# EAGLE design panelPrimer (EAGLE 9.4.2)
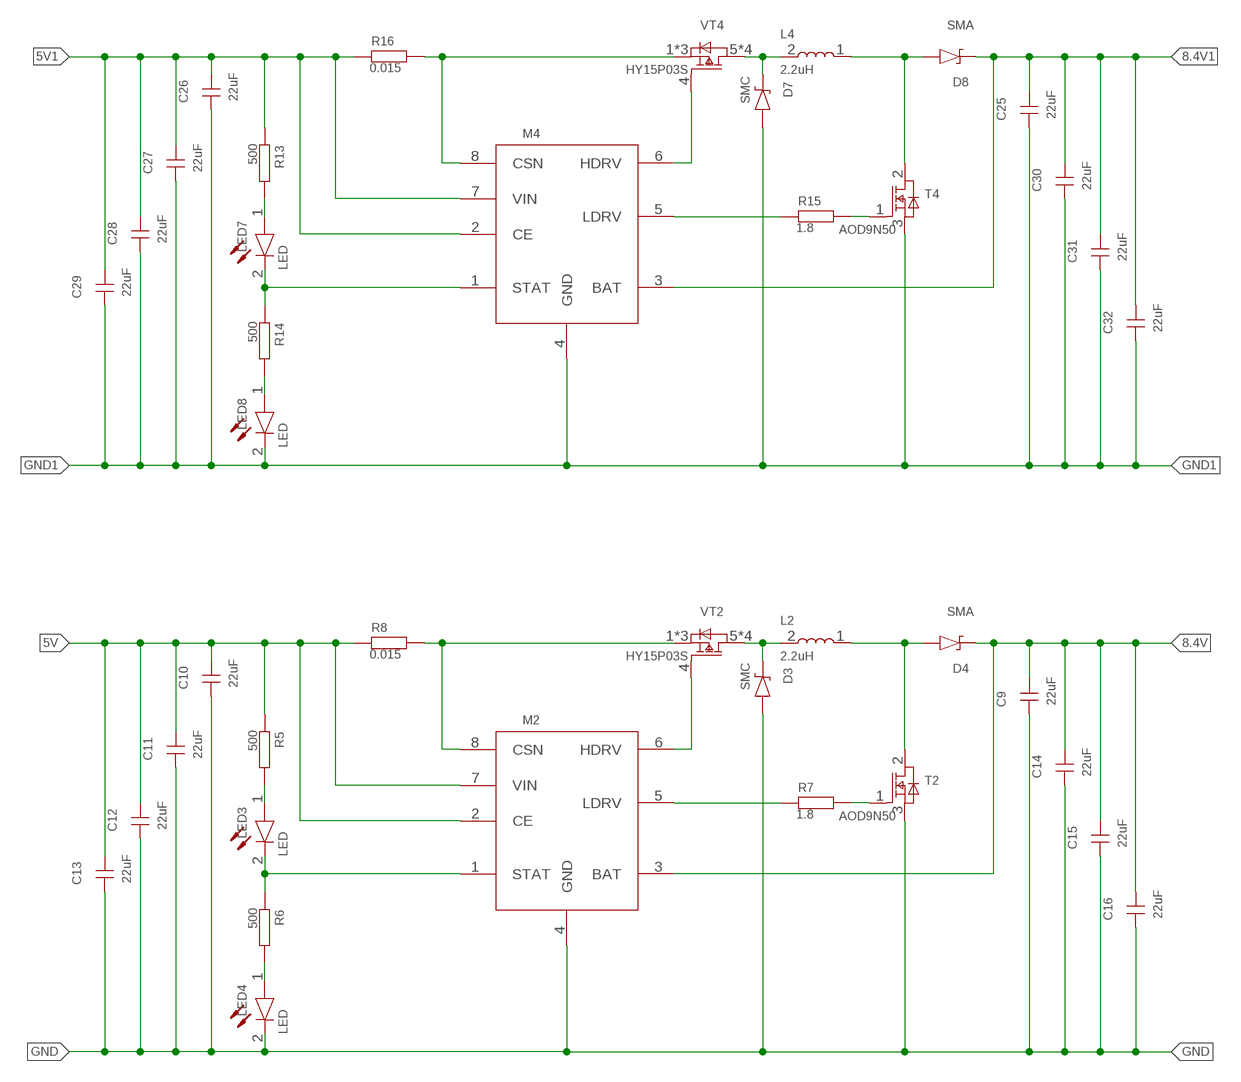
[diagram p0: schematic, sheet 1]

## Parts
C9  22uF  CAPACITOR  [1206]
C10  22uF  CAPACITOR  [1206]
C11  22uF  CAPACITOR  [1206]
C12  22uF  CAPACITOR  [1206]
C13  22uF  CAPACITOR  [1206]
C14  22uF  CAPACITOR  [1206]
C15  22uF  CAPACITOR  [1206]
C16  22uF  CAPACITOR  [1206]
C25  22uF  CAPACITOR  [1206]
C26  22uF  CAPACITOR  [1206]
C27  22uF  CAPACITOR  [1206]
C28  22uF  CAPACITOR  [1206]
C29  22uF  CAPACITOR  [1206]
C30  22uF  CAPACITOR  [1206]
C31  22uF  CAPACITOR  [1206]
C32  22uF  CAPACITOR  [1206]
D3  SMC  DIODESSMC  [SMC]
D4  SMA  DIODESSMA  [SMA]
D7  SMC  DIODESSMC  [SMC]
D8  SMA  DIODESSMA  [SMA]
L2  2.2uH  INDUCTORFXL0530-2R2-M  [FXL0530]
L4  2.2uH  INDUCTORFXL0530-2R2-M  [FXL0530]
LED3  LED  [LED]
LED4  LED  [LED]
LED7  LED  [LED]
LED8  LED  [LED]
M2  CN3302SOP-8  [SOP-8]
M4  CN3302SOP-8  [SOP-8]
R5  500  RESISTOR0603  [0603]
R6  500  RESISTOR0603  [0603]
R7  1.8  RESISTOR0603  [0603]
R8  0.015  RESISTOR2512  [2512]
R13  500  RESISTOR0603  [0603]
R14  500  RESISTOR0603  [0603]
R15  1.8  RESISTOR0603  [0603]
R16  0.015  RESISTOR2512  [2512]
T2  AOD9N50  AOD9N50  [DRACK]
T4  AOD9N50  AOD9N50  [DRACK]
VT2  HY15P03S  [SOP-8]
VT4  HY15P03S  [SOP-8]

## Nets
5V: C10.2 C11.2 C12.2 C13.2 M2.2(CE) M2.7(VIN) R5.1 R8.1
5V1: C26.2 C27.2 C28.2 C29.2 M4.2(CE) M4.7(VIN) R13.1 R16.1
8.4V: C9.2 C14.2 C15.2 C16.2 D4.2(C) M2.3(BAT)
8.4V1: C25.2 C30.2 C31.2 C32.2 D8.2(C) M4.3(BAT)
GND: C9.1 C10.1 C11.1 C12.1 C13.1 C14.1 C15.1 C16.1 D3.1(A) LED4.2(CATHODE) M2.4(GND) T2.3(S)
GND1: C25.1 C26.1 C27.1 C28.1 C29.1 C30.1 C31.1 C32.1 D7.1(A) LED8.2(CATHODE) M4.4(GND) T4.3(S)
N$16: LED3.1(ANODE) R5.2
N$17: LED4.1(ANODE) R6.2
N$18: M2.5(LDRV) R7.1
N$19: M2.8(CSN) R8.2 VT2.1(S) VT2.2(S) VT2.3(S)
N$20: R7.2 T2.1(G)
N$21: D3.2(C) L2.2 VT2.5(D) VT2.6(D) VT2.7(D) VT2.8(D)
N$22: D4.1(A) L2.1 T2.2(D)
N$23: LED3.2(CATHODE) M2.1(STAT) R6.1
N$24: M2.6(HDRV) VT2.4(G)
N$46: LED7.1(ANODE) R13.2
N$47: LED8.1(ANODE) R14.2
N$48: M4.5(LDRV) R15.1
N$49: M4.8(CSN) R16.2 VT4.1(S) VT4.2(S) VT4.3(S)
N$50: R15.2 T4.1(G)
N$51: D7.2(C) L4.2 VT4.5(D) VT4.6(D) VT4.7(D) VT4.8(D)
N$52: D8.1(A) L4.1 T4.2(D)
N$53: LED7.2(CATHODE) M4.1(STAT) R14.1
N$54: M4.6(HDRV) VT4.4(G)

## Library data of the parts
C9-C16 C25-C32 = 1_RESISTORS:CAPACITOR
D3 D4 D7 D8 = 1_DIODES:DIODES
L2 L4 = 1_INDUCTOR:INDUCTOR
LED3 LED4 LED7 LED8 = 1_LED:LED
M2 M4 = 1_MICRO:CN3302
R5-R8 R13-R16 = 1_RESISTORS:RESISTOR
T2 T4 = 1_TRANSISTORS:AOD9N50
VT2 VT4 = 1_TRANSISTORS:HY15P03S

## Board
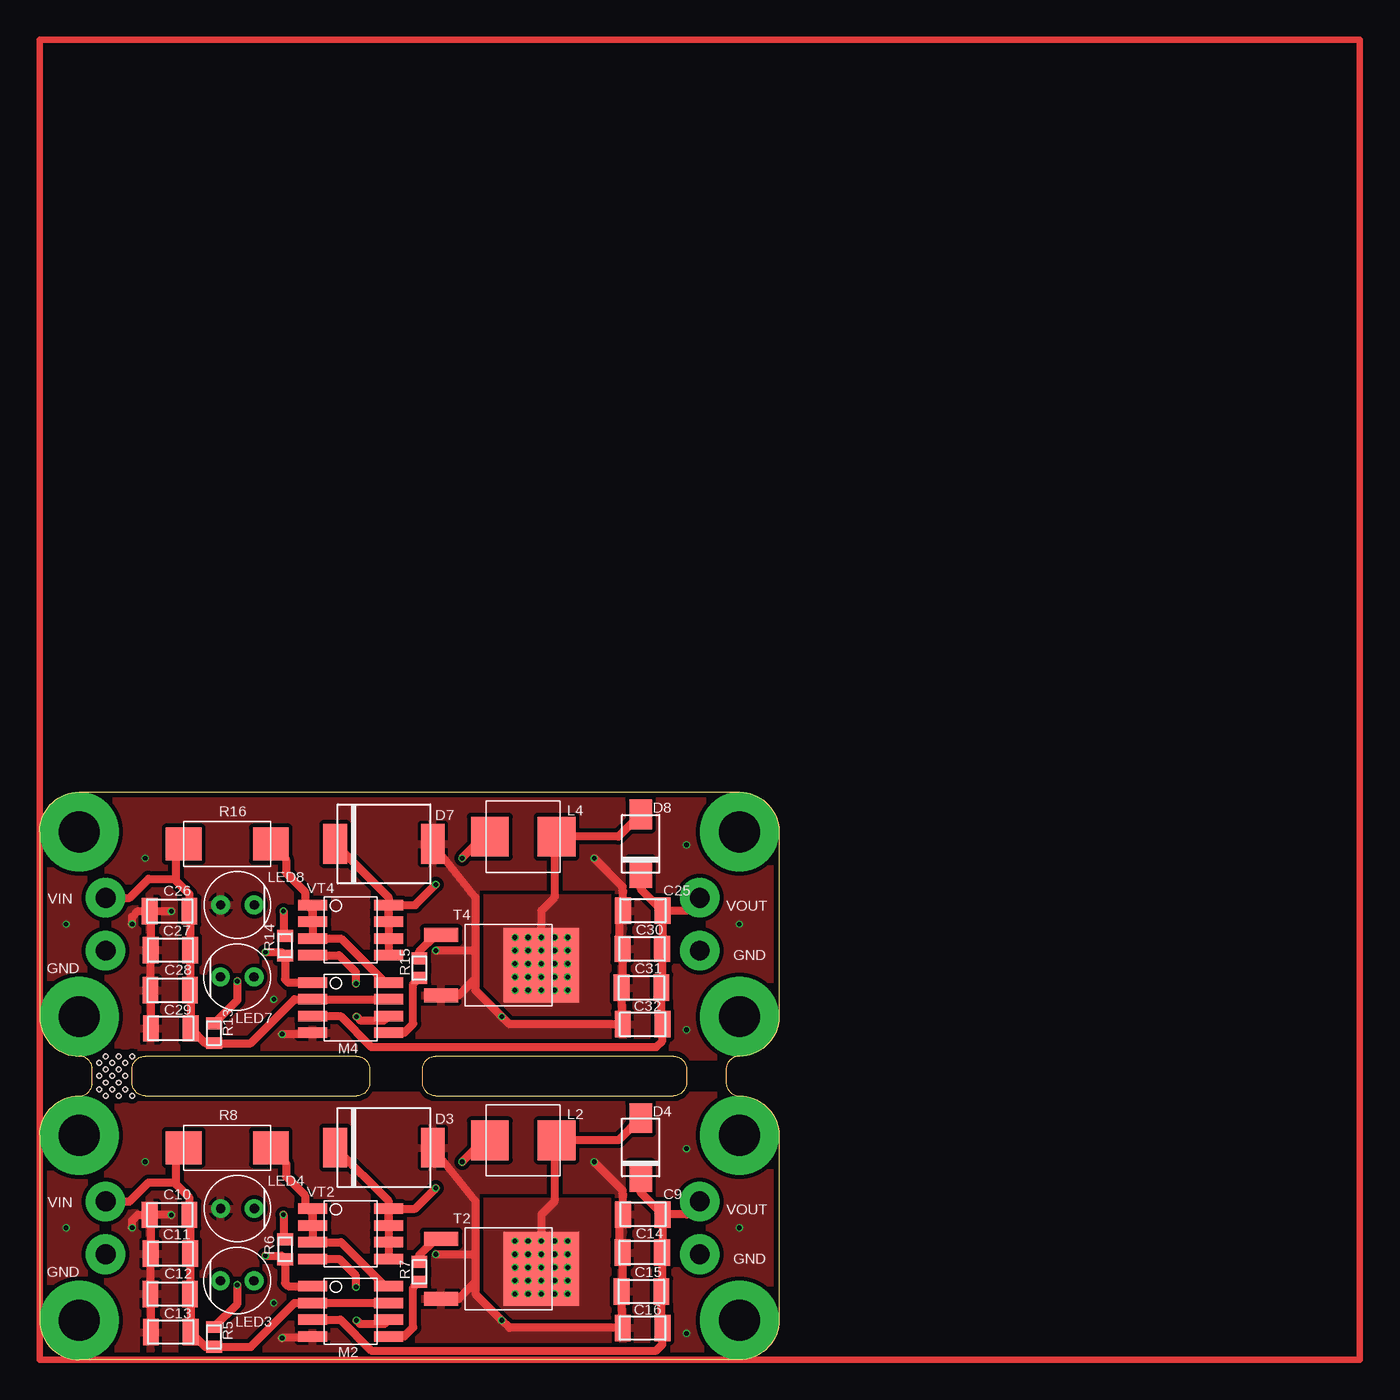
[diagram p1: board, top side]
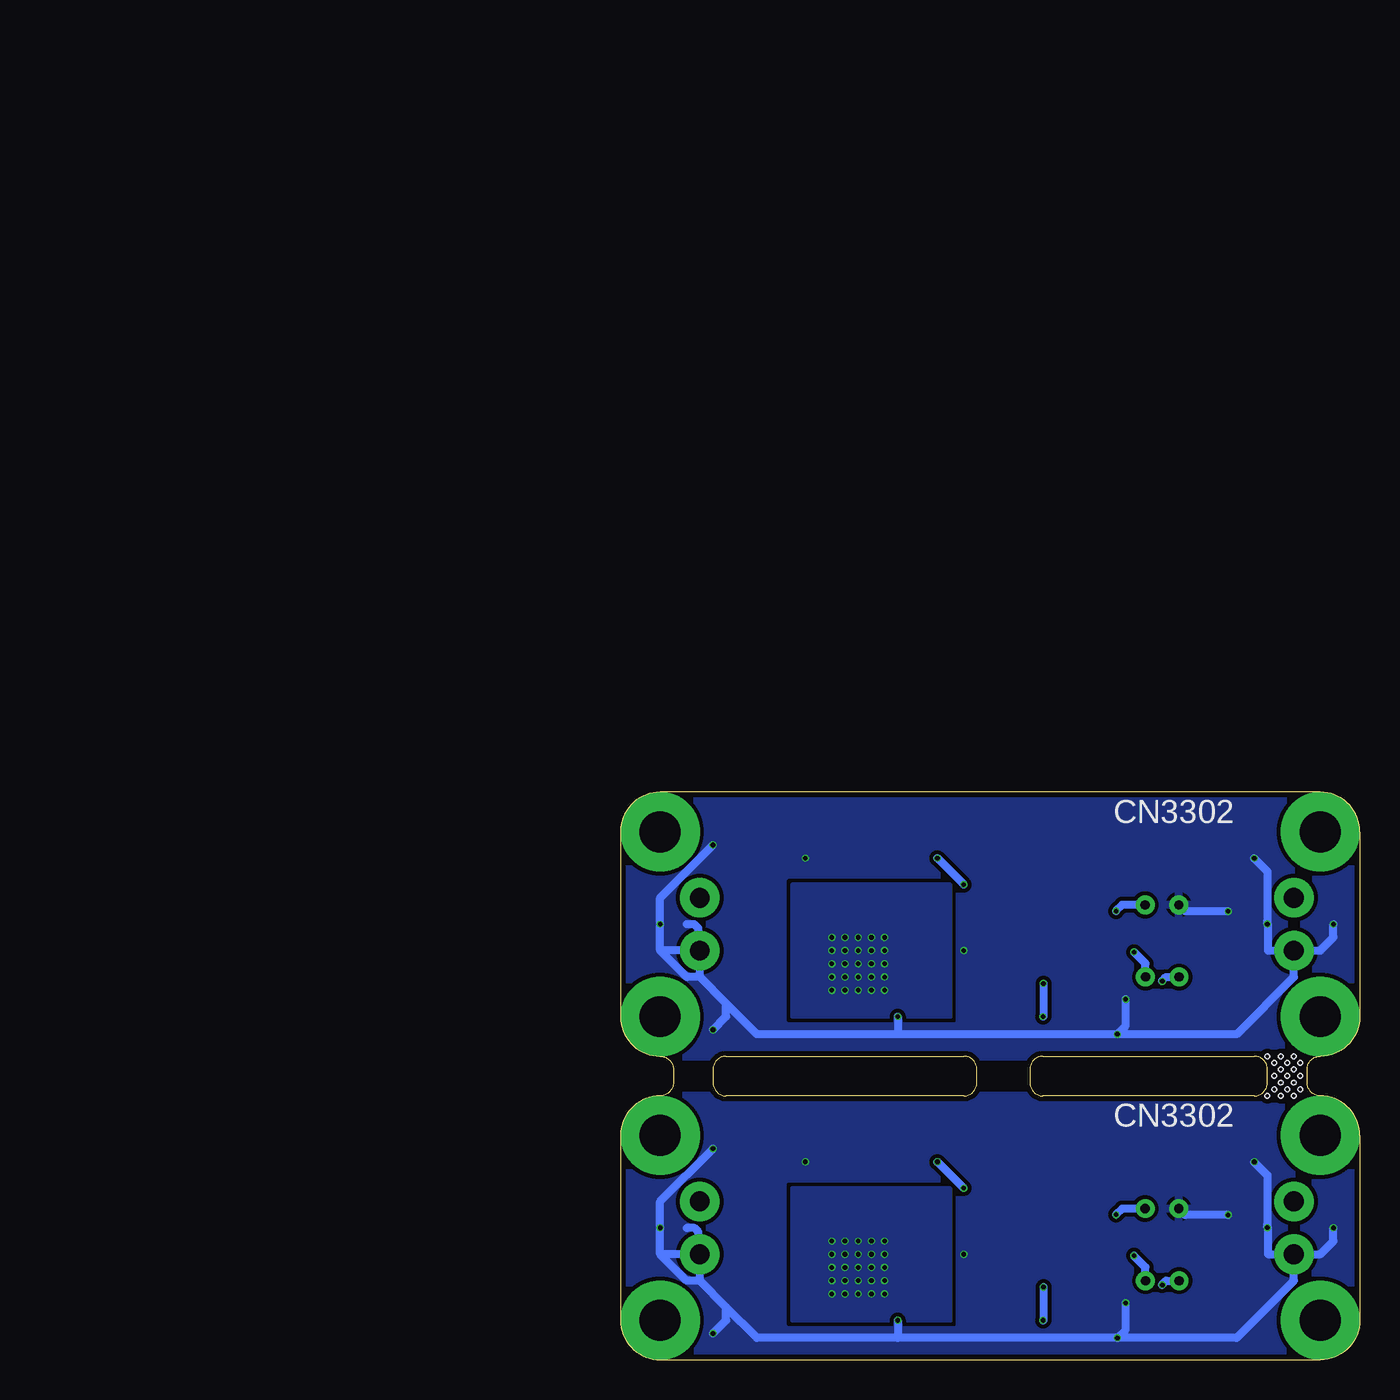
[diagram p2: board, bottom side, seen from below]

Size 56 x 43 mm. Coordinates in mm from the lower left corner, seen from the top.
Outline: 8,20 24,20 arc90 25,21 25,22 arc90 24,23 8,23 arc90 7,22 7,21 arc90 8,20
Outline: 30,20 48,20 arc90 49,21 49,22 arc90 48,23 30,23 arc90 29,22 29,21 arc90 30,20
Outline: 53,0 3,0 arc-90 0,3 0,17 arc-90 3,20 arc90 4,21 4,22 arc90 3,23 arc-90 0,26 0,40 arc-90 3,43 53,43 arc-90 56,40 56,26 arc-90 53,23 arc90 52,22 52,21 arc90 53,20 arc-90 56,17 56,3 arc-90 53,0
Copper layers (1*16): Top 0.035mm / dielectric 1.5mm / Bottom 0.035mm
Design rules "universal": minimum track width 6mil, minimum drill 0.3mm, track to track 6mil, track to pad 0.2mm, pad to pad 6mil, via to via 0.2mm, smd to smd 0mil, copper to edge 0.4mm, drill to drill 10mil, minimum pad ring 0.75mil, minimum via ring 0.75mil, stop-mask expansion 4mil, vias tented up to drill 3mm, thermal gap 10mil
Holes 0.35 mm at 4.5,22.5 5,23 5.5,22.5 6,23 6.5,22.5 7,23 5,22 6,22 4.5,21.5 5.5,21.5 6.5,21.5 5,21 6,21 4.5,20.5 5.5,20.5 6.5,20.5 5,20 6,20 7,20

### Footprints (pad centres in the part's own frame; a part is rotated, then mirrored left to right if it is on the bottom)
1206 = smd 1.2 x 2: 1 -1.5,0; 2 1.5,0
SMC = smd 1.8 x 3: 1 3.7,0; 2 -3.7,0
SMA = smd 2.25 x 1.7: 1 2.225,0; 2 -2.225,0
FXL0530 = smd 2.85 x 3: 1 2.525,0; 2 -2.525,0
LED = drill 0.7 pad 1.422: 1 1.27,0; 2 -1.27,0
SOP-8 = smd 0.8 x 2.2: 1 -1.905,-2.87; 2 -0.635,-2.87; 3 0.635,-2.87; 4 1.905,-2.87; 5 1.905,2.87; 6 0.635,2.87; 7 -0.635,2.87; 8 -1.905,2.87
0603 = smd 0.9 x 1.2: 1 -0.75,0; 2 0.75,0
2512 = smd 2.7 x 2.5: 1 -3.3,0; 2 3.3,0
DRACK = smd 2.6 x 1.06: 1 5.1,-2.286; 3 5.1,2.286 | smd 5.7 x 5.632: 2 -2.5,0

### Placement (x,y rotation side)
C9  45.69,11.02 0 top
C10  9.85,10.99 0 top
C11  9.91,8.04 0 top
C12  9.89,4.99 0 top
C13  9.93,2.11 0 top
C14  45.64,8.13 0 top
C15  45.58,5.18 0 top
C16  45.67,2.42 0 top
C25  45.69,34.02 0 top
C26  9.85,33.99 0 top
C27  9.91,31.04 0 top
C28  9.89,27.99 0 top
C29  9.93,25.11 0 top
C30  45.64,31.13 0 top
C31  45.58,28.18 0 top
C32  45.67,25.42 0 top
D3  26.08,16.08 0 top
D4  45.52,16.09 90 top
D7  26.08,39.08 0 top
D8  45.52,39.09 90 top
L2  36.63,16.63 0 top
L4  36.63,39.63 0 top
LED3  14.97,6 180 top
LED4  14.99,11.46 0 top
LED7  14.97,29 180 top
LED8  14.99,34.46 0 top
M2  23.56,3.68 270 top
M4  23.56,26.68 270 top
R5  13.21,1.74 90 top
R6  18.59,8.37 90 top
R7  28.76,6.67 90 top
R8  14.21,16.07 0 top
R13  13.21,24.74 90 top
R14  18.59,31.37 90 top
R15  28.76,29.67 90 top
R16  14.21,39.07 0 top
T2  35.51,6.9 180 top
T4  35.51,29.9 180 top
VT2  23.55,9.55 270 top
VT4  23.55,32.55 270 top

### Tracks (layer width: path | path; a pad name or v marks a point on that pad's centre or on a via)
5V  (via drill 1.5 pad 3)
  Top 0.61: C10.2 11.41,10.93 C11.2 11.39,8.02 C12.2 11.43,4.95 C13.2 12.55,0.99 R5.1 15.99,0.99 19.32,4.32 M2.2 M2.7 | R8.1 10.33,15.49 10.33,13.43 | C10.2 11.44,11.08 | 6.82,12 | v5,12 6.82,12 | 6.82,12 8.25,13.43 10.33,13.43 | 10.33,13.43 10.33,13.28 11.35,12.26 C10.2
5V1  (via drill 1.5 pad 3)
  Top 0.61: C26.2 11.41,33.93 C27.2 11.39,31.02 C28.2 11.43,27.95 C29.2 12.55,23.99 R13.1 15.99,23.99 19.32,27.32 M4.2 M4.7 | R16.1 10.33,38.49 10.33,36.43 | C26.2 11.44,34.08 | 6.82,35 | v5,35 6.82,35 | 6.82,35 8.25,36.43 10.33,36.43 | 10.33,36.43 10.33,36.28 11.35,35.26 C26.2
8.4V  (via drill 1.5 pad 3)
  Top 0.61: C9.2 47.06,10.89 47.06,10.7 | 47.13,5.23 C15.2 | C15.2 47.08,5.11 | 46.87,4.9 47.08,5.11 | 47.08,5.11 47.14,5.17 C14.2 47.19,8.18 C9.2 | 47.14,2.45 C16.2 | C16.2 47.08,2.51 C15.2 | v50,12 49.02,11.02 C9.2 | C9.2 45.52,12.69 D4.2 | M2.3 22.78,3.04 25.12,0.7 46.7,0.7 47.17,1.17 C16.2
8.4V1  (via drill 1.5 pad 3)
  Top 0.61: C25.2 47.06,33.89 47.06,33.7 | 47.13,28.23 C31.2 | C31.2 47.08,28.11 | 46.87,27.9 47.08,28.11 | 47.08,28.11 47.14,28.17 C30.2 47.19,31.18 C25.2 | 47.14,25.45 C32.2 | C32.2 47.08,25.51 C31.2 | v50,35 49.02,34.02 C25.2 | C25.2 45.52,35.69 D8.2 | M4.3 22.78,26.05 25.12,23.7 46.7,23.7 47.17,24.17 C32.2
GND  (via drill 0.35)
  Top 0.61: C10.1 | C10.1 8.41,10.93 C11.1 8.39,8.02 C12.1 8.43,4.95 C13.1 | C13.1 8.43,1.87 | C14.1 43.94,8.33 43.94,10.29 43.97,10.32 | C14.1 44.14,5.24 C15.1 44.08,2.51 C16.1 35.58,2.42 v35,3 32.98,5.01 32.98,5.86 | C13.1 8.43,2.34 | D3.1 32.98,12.04 32.98,8 | 32.98,8 32.98,5.86 | 32.98,5.86 31.74,4.61 T2.3 | 44.19,8.08 C14.1 | v9.97,10.98 C10.1 | v7.01,10.01 7.01,10.56 7.44,10.99 C10.1 | 43.97,10.32 44.19,10.54 C9.1 44.19,12.51 44.16,12.53 44.16,12.84 v42,15 | 43.97,10.32 44,10.35 | v30,8 32.98,8 | M2.4 20.59,1.67 v18.37,1.67
  Bottom 0.61: v18.37,1.67 9.33,1.67 5,6 5,8 | v18.37,1.67 35,1.67 | 35,1.67 45.67,1.67 48,4 | v8,15 8,14.97 7.01,13.98 v7.01,10.01 | v7.01,10.01 7.01,10.33 | LED4.2 13.24,10.98 v9.97,10.98 | 48,4 49.99,6 | v35,3 35,1.67 | 49.99,6 49.99,7.91 50.09,8 | 50.09,8 50.1,8.01 50.1,9.69 50.41,10 51,10 | 53,8 50.99,6 49.99,6 | 50.09,8 53,8 | 53,8 v53,10 53,12 v49,16 | v49,2 48,3 48,4 | v7.01,10.01 6.97,9.97 6.97,8 5,8 | 5,8 3,8 2,9 v2,10 | v18.37,1.67 17.74,2.3 v17.74,4.31
  pour Top (isolate 0.3, rank 2): 56,20 0,20 0,0 56,0
  pour Bottom (isolate 0.3, rank 2): 0,0 0,20 56,20 56,0
GND1  (via drill 0.35)
  Top 0.61: C26.1 | C26.1 8.41,33.93 C27.1 8.39,31.02 C28.1 8.43,27.95 C29.1 | C29.1 8.43,24.87 | C30.1 43.94,31.33 43.94,33.29 43.97,33.32 | C30.1 44.14,28.24 C31.1 44.08,25.51 C32.1 35.58,25.42 v35,26 32.98,28.02 32.98,28.86 | C29.1 8.43,25.34 | D7.1 32.98,35.04 32.98,31 | 32.98,31 32.98,28.86 | 32.98,28.86 31.74,27.61 T4.3 | 44.19,31.08 C30.1 | v9.97,33.98 C26.1 | v7.01,33.01 7.01,33.56 7.44,33.99 C26.1 | 43.97,33.32 44.19,33.53 C25.1 44.19,35.51 44.16,35.53 44.16,35.84 v42,38 | 43.97,33.32 44,33.35 | v30,31 32.98,31 | M4.4 20.59,24.67 v18.37,24.67
  Bottom 0.61: v18.37,24.67 9.33,24.67 5,29 5,31 | v18.37,24.67 35,24.67 | 35,24.67 45.67,24.67 48,27 | v8,38 8,37.97 7.01,36.98 v7.01,33.01 | v7.01,33.01 7.01,33.33 | LED8.2 13.24,33.98 v9.97,33.98 | 48,27 49.99,29 | v35,26 35,24.67 | 49.99,29 49.99,30.91 50.09,31 | 50.09,31 50.1,31.01 50.1,32.69 50.41,33 51,33 | 53,31 50.99,29 49.99,29 | 50.09,31 53,31 | 53,31 v53,33 53,35 v49,39 | v49,25 48,26 48,27 | v7.01,33.01 6.97,32.97 6.97,31 5,31 | 5,31 3,31 2,32 v2,33 | v18.37,24.67 17.74,25.3 v17.74,27.31
  pour Top (isolate 0.3, rank 2): 56,43 0,43 0,23 56,23
  pour Bottom (isolate 0.3, rank 2): 0,23 0,43 56,43 56,23
N$1
  Top 0.5: 0,0 100,0 100,100 0,100 0,0
N$16  (via drill 0.35)
  Top 0.61: v14.96,5.67 14.98,5.67 14.98,4.26 R5.2
  Bottom 0.61: v14.96,5.67 14.96,5.71 14.68,5.99 LED3.1
N$17  (via drill 0.35)
  Top 0.61: v18.46,10.99 18.46,9.24 R6.2
  Bottom 0.61: LED4.1 18.01,11.46 v18.47,11 v18.46,10.99
N$18
  Top 0.61: M2.5 27.61,1.77 28.3,2.46 28.3,5.49 28.72,5.92 R7.1
N$19
  Top 0.61: VT2.1 VT2.2 | VT2.2 VT2.3 22.83,8.91 26.16,5.58 M2.8 | R8.2 18.66,14.92 18.66,13.9 20.1,12.46 20.1,11.64 | 20.1,11.64 20.14,11.68 | VT2.2 20.68,11.06 20.1,11.64
N$20
  Top 0.61: R7.2 28.76,7.93 30.01,9.19 T2.1
N$21  (via drill 0.35)
  Top 0.61: VT2.8 VT2.7 VT2.6 VT2.5 26.68,7.64 | 26.42,10.72 VT2.8 | D3.2 26.42,12.04 VT2.8 | VT2.8 28.45,11.46 v30,13 | v32,15 33.63,16.63 L2.2
  Bottom 0.61: v30,13 v32,15
N$22  (via drill 0.35)
  Top 0.61: T2.2 38.01,11.01 39,12 39,16.48 L2.1 43.84,16.63 D4.1
  other vias: 40,9 36,9 37,9 38,9 39,9 39,8 39,7 36,8 36,7 37,7 38,7 37,8 40,8 40,7 36,6 37,6 38,6 39,6 40,6 36,5 37,5 38,5 39,5 40,5 38,8
  pour Top (isolate 0.3, no thermals): 31,12.16 43.17,12.16 43.17,3 31,3
  pour Bottom (isolate 0.3): 31,13 43,13 43,3 31,3
N$23  (via drill 0.35)
  Top 0.61: M2.1 18.82,5.58 18.59,5.82 R6.1 18.32,7.89 v17.11,7.89
  Bottom 0.61: LED3.2 16.24,7.03 v17.11,7.89
N$24  (via drill 0.35)
  Top 0.61: 26.41,3.06 M2.6 26.11,2.73 24.27,2.73 v24,3 | VT2.4 22.68,7.64 23.97,6.36 v23.97,5.51
  Bottom 0.61: v23.97,5.51 23.97,3.03 v24,3
N$25  (via drill 3.1 pad 6)
  other vias: 3,17
N$26  (via drill 3.1 pad 6)
  other vias: 3,3
N$27  (via drill 3.1 pad 6)
  other vias: 53,3
N$28  (via drill 3.1 pad 6)
  other vias: 53,17
N$29  (via drill 1.5 pad 3)
  other vias: 50,8
N$30  (via drill 1.5 pad 3)
  other vias: 5,8
N$46  (via drill 0.35)
  Top 0.61: v14.96,28.68 14.98,28.68 14.98,27.27 R13.2
  Bottom 0.61: v14.96,28.68 14.96,28.71 14.68,28.99 LED7.1
N$47  (via drill 0.35)
  Top 0.61: v18.46,33.99 18.46,32.24 R14.2
  Bottom 0.61: LED8.1 18.01,34.46 v18.47,34 v18.46,33.99
N$48
  Top 0.61: M4.5 27.61,24.77 28.3,25.45 28.3,28.49 28.72,28.92 R15.1
N$49
  Top 0.61: VT4.1 VT4.2 | VT4.2 VT4.3 22.83,31.91 26.16,28.59 M4.8 | R16.2 18.66,37.92 18.66,36.9 20.1,35.46 20.1,34.64 | 20.1,34.64 20.14,34.68 | VT4.2 20.68,34.06 20.1,34.64
N$50
  Top 0.61: R15.2 28.76,30.93 30.01,32.19 T4.1
N$51  (via drill 0.35)
  Top 0.61: VT4.8 VT4.7 VT4.6 VT4.5 26.68,30.64 | 26.42,33.72 VT4.8 | D7.2 26.42,35.04 VT4.8 | VT4.8 28.45,34.45 v30,36 | v32,38 33.63,39.63 L4.2
  Bottom 0.61: v30,36 v32,38
N$52  (via drill 0.35)
  Top 0.61: T4.2 38.01,34.01 39,35 39,39.48 L4.1 43.84,39.63 D8.1
  other vias: 40,32 36,32 37,32 38,32 39,32 39,31 39,30 36,31 36,30 37,30 38,30 37,31 40,31 40,30 36,29 37,29 38,29 39,29 40,29 36,28 37,28 38,28 39,28 40,28 38,31
  pour Top (isolate 0.3, no thermals): 31,35.16 43.17,35.16 43.17,26 31,26
  pour Bottom (isolate 0.3): 31,36 43,36 43,26 31,26
N$53  (via drill 0.35)
  Top 0.61: M4.1 18.82,28.59 18.59,28.82 R14.1 18.32,30.89 v17.11,30.89
  Bottom 0.61: LED7.2 16.24,30.03 v17.11,30.89
N$54  (via drill 0.35)
  Top 0.61: 26.41,26.06 M4.6 26.11,25.73 24.27,25.73 v24,26 | VT4.4 22.68,30.64 23.97,29.36 v23.97,28.51
  Bottom 0.61: v23.97,28.51 23.97,26.03 v24,26
N$55  (via drill 3.1 pad 6)
  other vias: 3,40
N$56  (via drill 3.1 pad 6)
  other vias: 3,26
N$57  (via drill 3.1 pad 6)
  other vias: 53,26
N$58  (via drill 3.1 pad 6)
  other vias: 53,40
N$59  (via drill 1.5 pad 3)
  other vias: 50,31
N$60  (via drill 1.5 pad 3)
  other vias: 5,31

### Text on the board
tPlace: VIN | GND | GND | VIN | GND | GND
tNames: VOUT | VOUT
bNames: CN3302 | CN3302